# Altium project CW308T_MSP430FR5xxx.PrjPcb
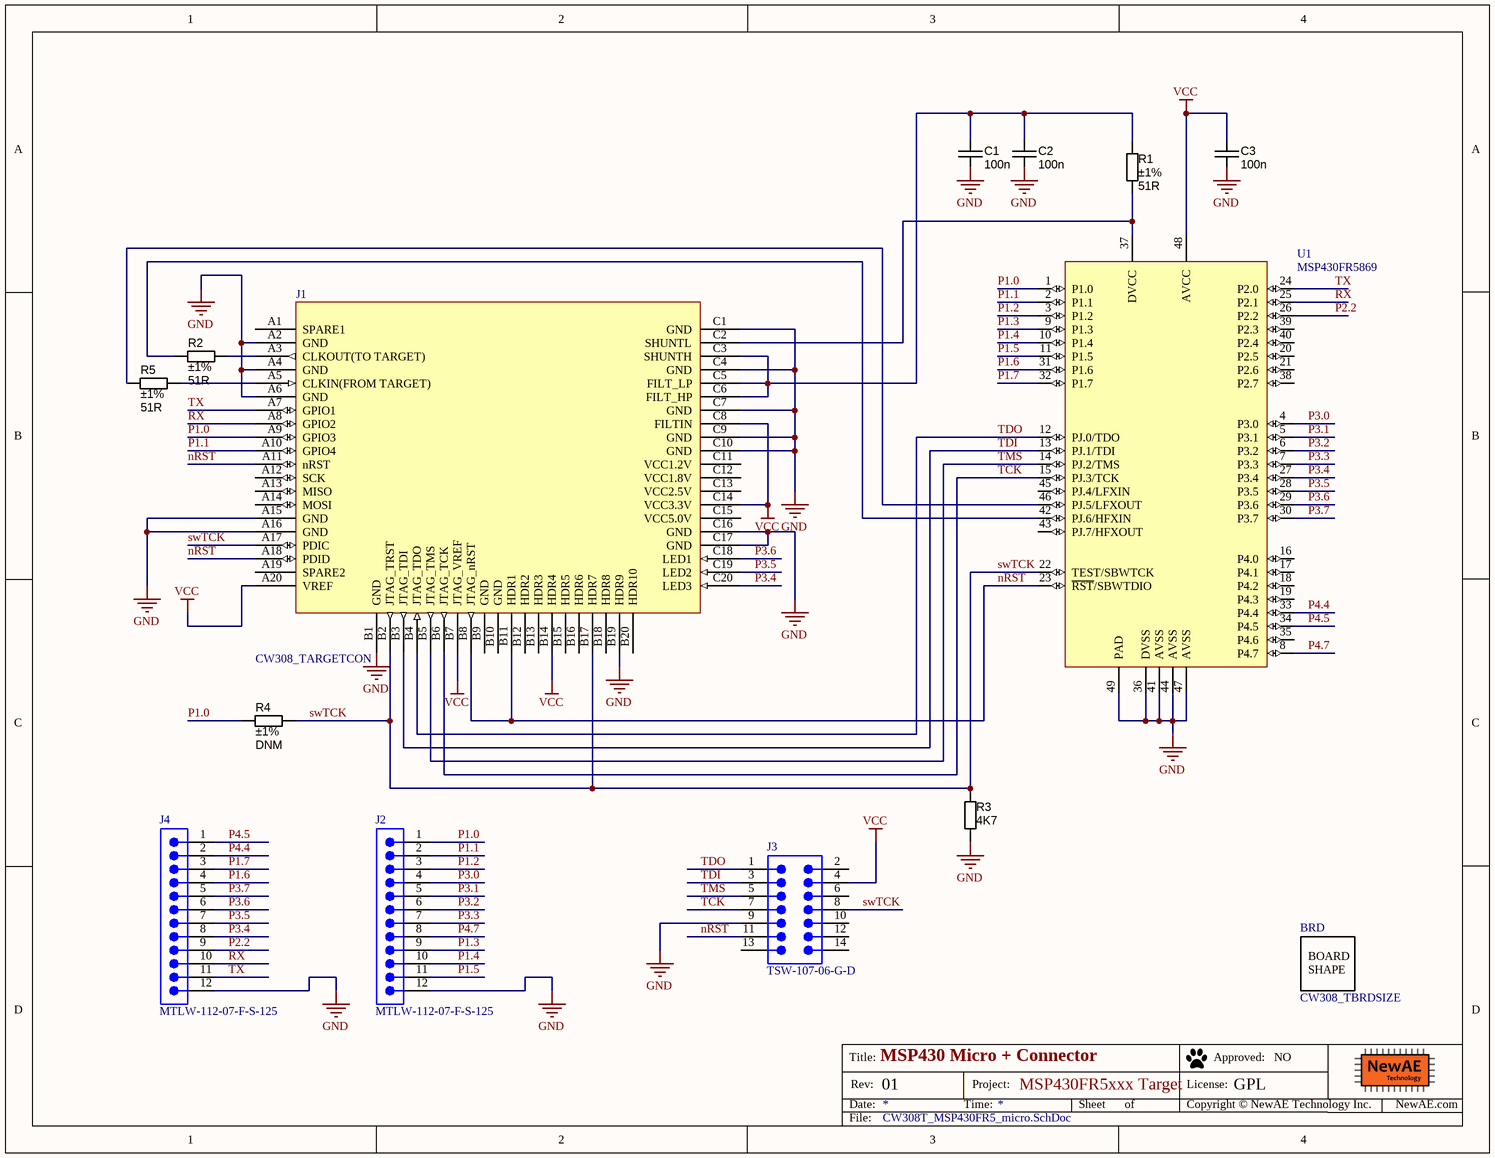
[diagram p0: CW308T_MSP430FR5_micro.SchDoc]
PrjLicense: GPL; PrjName: MSP430FR5xxx Target; PrjRev: 01
1 sheet, 14 parts. Net scope: global (net labels, ports and power ports of the same name join across sheets).
Board files: CW308T_MSP430FR5xxx.PcbDoc, CW308T_MSP430FR5_PANEL.PcbDoc

## Sheet CW308T_MSP430FR5_micro.SchDoc: MSP430 Micro + Connector
size Letter; Organization: NewAE Technology Inc.; Address1: 1083 Queen St., Suite 196; Address2: Halifax; Address3: NS; Address4: Canada B3H 0B2; SheetApproved: NO; PageSetup: Record=PageOptions|CenterHorizontal=True|CenterVertical=True|PrintScale=0.98|XCorrection=1.00|YCorrection=1.00|PrintKind=0|BorderSize=5000000|LeftOffset=0|BottomOffset=0|Orientation=2|PaperLength=1000|PaperWidth=1000|Scale=100|PaperSource=7|PrintQuality=-3|MediaType=1|DitherType=10|PrintScaleMode=1|PaperKind=Letter|PaperIndex=1

### Parts
BRD  CW308_TBRDSIZE  [CW308T_TBOARD_DEFSIZE]
C1  value 100n  [CAPC1608X90N]  (hidden comment: approved sub OK)
C2  value 100n  [CAPC1608X90N]  (hidden comment: approved sub OK)
C3  value 100n  [CAPC1608X90N]  (hidden comment: approved sub OK)
J1  CW308_TARGETCON  [CW308_TBOARD_CONN]
J2  MTLW-112-07-F-S-125  [SMTC-MTLW-112-07-X-S-125]
J3  TSW-107-06-G-D  [SMTC-TSW-107-06-X-D]
J4  MTLW-112-07-F-S-125  [SMTC-MTLW-112-07-X-S-125]
R1  value 51R  Tolerance: ±1%  [RESC1608X55N]  (hidden comment: Thick Film)
R2  value 51R  Tolerance: ±1%  [RESC1608X55N]  (hidden comment: Thick Film)
R3  value 4K7  [RESC1608X55N]  (hidden comment: Thick Film)
R4  value DNM  Tolerance: ±1%  [RESC1608X55N]  (hidden comment: Thick Film)
R5  value 51R  Tolerance: ±1%  [RESC1608X55N]  (hidden comment: Thick Film)
U1  MSP430FR5869  [QFN50P700X700X100_HS-49M]

### Nets
GND: C1.2 C2.2 C3.2 J1.A2(GND) J1.A4(GND) J1.A6(GND) J1.A15(GND) J1.A16(GND) J1.B1(GND) J1.B19(HDR9) J1.C1(GND) J1.C4(GND) J1.C7(GND) J1.C9(GND) J1.C10(GND) J1.C16(GND) J1.C17(GND) J2.12 J3.9 J4.12 R3.2 U1.36(DVSS) U1.41(AVSS) U1.44(AVSS) U1.47(AVSS) U1.49(PAD)
VCC: C3.1 J1.A20(VREF) J1.B7(JTAG_VREF) J1.B14(HDR4) J1.C8(FILTIN) J1.C14(VCC3.3V) J3.4 U1.48(AVCC)
nRST: J1.A11(nRST) J1.A18(PDID) J1.B8(JTAG_nRST) J1.B11(HDR1) J3.11 U1.23(~{RST}/SBWTDIO)
P1.0: J1.A9(GPIO3) J2.1 R4.1 U1.1(P1.0)
P1.1: J1.A10(GPIO4) J2.2 U1.2(P1.1)
P1.2: J2.3 U1.3(P1.2)
P1.3: J2.9 U1.9(P1.3)
P1.4: J2.10 U1.10(P1.4)
P1.5: J2.11 U1.11(P1.5)
P1.6: J4.4 U1.31(P1.6)
P1.7: J4.3 U1.32(P1.7)
P2.2: J4.9 U1.26(P2.2)
P3.0: J2.4 U1.4(P3.0)
P3.1: J2.5 U1.5(P3.1)
P3.2: J2.6 U1.6(P3.2)
P3.3: J2.7 U1.7(P3.3)
P3.4: J1.C20(LED3) J4.8 U1.27(P3.4)
P3.5: J1.C19(LED2) J4.7 U1.28(P3.5)
P3.6: J1.C18(LED1) J4.6 U1.29(P3.6)
P3.7: J4.5 U1.30(P3.7)
P4.4: J4.2 U1.33(P4.4)
P4.5: J4.1 U1.34(P4.5)
P4.7: J2.8 U1.8(P4.7)
RX: J1.A8(GPIO2) J4.10 U1.25(P2.1)
swTCK: J1.A17(PDIC) J1.B2(JTAG_TRST) J1.B17(HDR7) J3.8 R3.1 R4.2 U1.22(TEST/SBWTCK)
TCK: J1.B6(JTAG_TCK) J3.7 U1.15(PJ.3/TCK)
TDI: J1.B3(JTAG_TDI) J3.3 U1.13(PJ.1/TDI)
TDO: J1.B4(JTAG_TDO) J3.1 U1.12(PJ.0/TDO)
TMS: J1.B5(JTAG_TMS) J3.5 U1.14(PJ.2/TMS)
TX: J1.A7(GPIO1) J4.11 U1.24(P2.0)
NetC1_1: C1.1 C2.1 J1.C3(SHUNTH) J1.C5(FILT_LP) J1.C6(FILT_HP) R1.1
NetJ1_A3: J1.A3(CLKOUT(TO_TARGET)) R2.2
NetJ1_A5: J1.A5(CLKIN(FROM_TARGET)) R5.2
NetJ1_C2: J1.C2(SHUNTL) R1.2 U1.37(DVCC)
NetR2_1: R2.1 U1.42(PJ.6/HFXIN)
NetR5_1: R5.1 U1.46(PJ.5/LFXOUT)

Not connected (* = marked no-connect by the designer): J1 A1(SPARE1) A12(SCK) A13(MISO) A14(MOSI) A19(SPARE2) B9(GND) B10(GND) B12(HDR2) B13(HDR3) B15(HDR5) B16(HDR6) B18(HDR8) B20(HDR10) C11(VCC1.2V) C12(VCC1.8V) C13(VCC2.5V) C15(VCC5.0V); J3 2 6 10 12 13 14; U1 16(P4.0) 17(P4.1) 18(P4.2) 19(P4.3) 20(P2.5) 21(P2.6) 35(P4.6) 38(P2.7) 39(P2.3) 40(P2.4) 43(PJ.7/HFXOUT) 45(PJ.4/LFXIN)

### Notes on the sheet
- Title:
- Date:
- Rev:
- Time:
- Project:
- Sheet
- of
- License:
- Copyright © NewAE Technology Inc.
- Approved:
- NewAE.com
- File:
- (in symbol CW308T_BRDSHAPE_DEFAULT) BOARD / SHAPE

### Library data of the parts
BRD = CW308T_BRDSHAPE_DEFAULT: 308T Board Outline (Layer 1); Component Group: Mechanical; Part Number: CW308T_BRDSHAPE_DEFAULT; Component Kind: Mechanical; Component Type: Mechanical
C1-C3 = CAPC_100n_0603_X7R_50V_10%: Capacitor SMD Cer 100nF 10% 50V X7R 0603; Manufacturer 1: AVX Corporation; Manufacturer Part Number 1: 06035C104KAT2A; Ratings: 50V; X7R; Material: ceramic; SCDType: spec; Manufacturer 2: TDK Corporation; Manufacturer Part Number 2: C1608X7R1H104K; Package / Case: 0603 (1608 Metric); Tolerance: ±10%; Supplier 1: Digi-Key; Supplier Part Number 1: 478-5052-1-ND; ComponentLink1URL: http://www.avx.com/docs/Catalogs/cx7r.pdf; ComponentLink1Description: http://www.avx.com/docs/Catalogs/cx7r.pdf; Supplier 2: Digi-Key; Supplier Part Number 2: 445-1314-1-ND; ComponentLink2URL: http://product.tdk.com/capacitor/mlcc/en/documents/mlcc_commercial_general_en.pdf; ComponentLink2Description: http://product.tdk.com/capacitor/mlcc/en/documents/mlcc_commercial_general_en.pdf
J1 = CW308_TBOARD: CW308 "Standard" Target Board Connector
J2 J4 = CMP-1024-00086-1: Manufacturer: Samtec; Pitch: 2.54 mm; Temperature Range: -55 to 125 degC; PackageDescription: Low Profile Terminal Assembly; Mounting Technology: Through-hole; PackageReference: MTLW-112-07-X-S-125; ComponentLink2Description: Datasheet; Orientation: Vertical; ComponentLink3URL: http://www.samtec.com/documents/webfiles/cpdf/MTLW-1XX-XX-XX-X-XXX-XX-XX-MKT1.pdf; ComponentLink3Description: Package Specification; PackageVersion: T, 6/1991; PartNumber: MTLW-112-07-F-S-125; DatasheetVersion: F-214; ComponentLink1Description: Manufacturer URL; RoHS: True; ComponentLink2URL: http://www.samtec.com/documents/webfiles/pdf/MTLW_TH.PDF; ComponentLink1URL: http://www.samtec.com
J3 = CMP-1024-00403-1: Manufacturer: Samtec; Pitch: 2.54 mm; ComponentLink1Description: Manufacturer URL; PackageReference: TSW-107-06-X-D; PackageVersion: DM, 8/1988; DatasheetVersion: F-214; Temperature Range: -55 to 125 degC; ComponentLink3Description: Package Specification; ComponentLink1URL: http://www.samtec.com; PackageDescription: .025[0.64] SQ. Post Terminal Strip Assembly; ComponentLink3URL: http://www.samtec.com/documents/webfiles/cpdf/TSW-XXX-XX-XXX-X-XX-XXX-MKT.pdf; ComponentLink2Description: Datasheet; Orientation: Vertical; PartNumber: TSW-107-06-G-D; Mounting Technology: Through-hole; RoHS: True; ComponentLink2URL: http://www.samtec.com/documents/webfiles/pdf/TSW_TH.PDF
R1 R2 R4 R5 = RES_51R_0603_1%: Resistor SMD chip 51 Ohm 0.1W 1% 0603; Manufacturer 1: Yageo; Manufacturer Part Number 1: RC0603FR-0751RL; Ratings: 1/10 W; SCDType: spec; Package / Case: 0603 (1608 metric); Material: Thick Film; Supplier 1: Digi-Key; Supplier Part Number 1: 311-51.0HRCT-ND
R3 = RES_4K7_0603_5%: Resistor SMD chip 4.7k Ohm 0.1W 5% 0603; Manufacturer 1: Vishay/Dale; Manufacturer Part Number 1: CRCW06034K70JNEA; Ratings: 1/10 W; SCDType: spec; Package / Case: 0603 (1608 metric); Tolerance: ±5%; Material: Thick Film; Supplier 1: Digi-Key; Supplier Part Number 1: 541-4.7KGCT-ND
U1 = MSP430FR869: MSP430, 16-bit MCU, FR sram